# Altium schematic sheet RNG_entropy.SchDoc
size A4; SheetNumber: 2; SheetTotal: 2
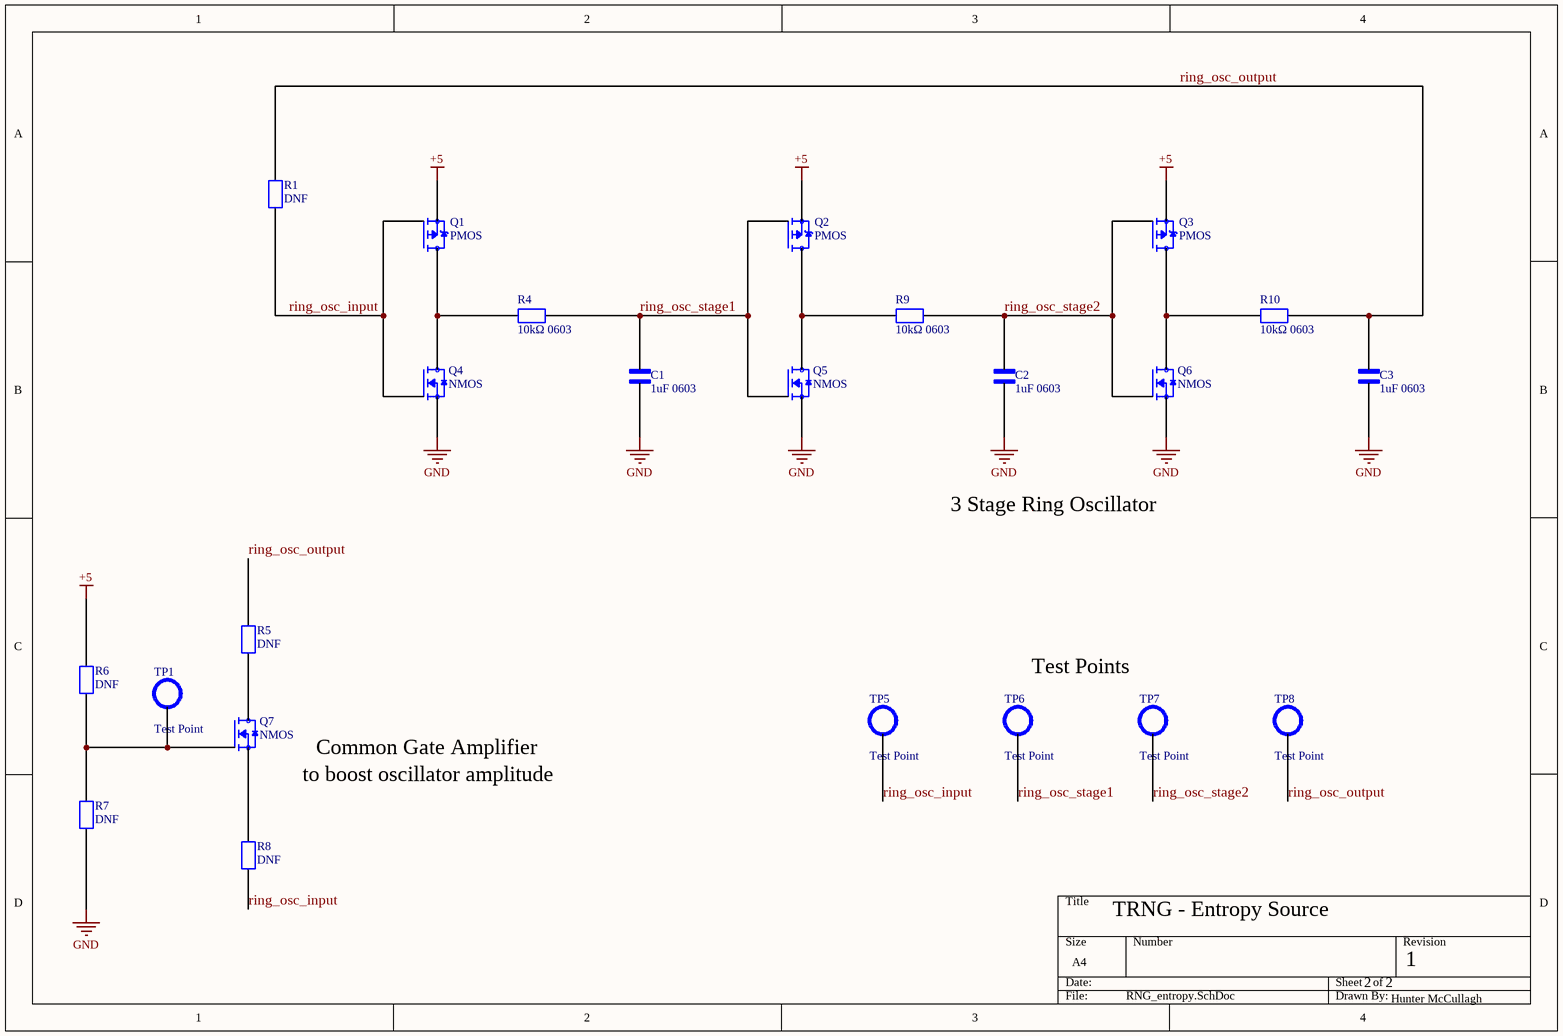
[diagram p0: RNG_entropy.SchDoc]

## Parts
C1  1uF 0603  [0603 PACKAGE]
C2  1uF 0603  [0603 PACKAGE]
C3  1uF 0603  [0603 PACKAGE]
Q1  PMOS  [SOT23-3]
Q2  PMOS  [SOT23-3]
Q3  PMOS  [SOT23-3]
Q4  NMOS  [SOT23-3]
Q5  NMOS  [SOT23-3]
Q6  NMOS  [SOT23-3]
Q7  NMOS  [SOT23-3]
R1  DNF  [0402 PACKAGE]
R4  10kΩ 0603  [0603 PACKAGE]
R5  DNF  [0402 PACKAGE]
R6  DNF  [0603 PACKAGE]
R7  DNF  [0603 PACKAGE]
R8  DNF  [0402 PACKAGE]
R9  10kΩ 0603  [0603 PACKAGE]
R10  10kΩ 0603  [0603 PACKAGE]
TP1  Test Point  [Test Point]
TP5  Test Point  [Test Point]
TP6  Test Point  [Test Point]
TP7  Test Point  [Test Point]
TP8  Test Point  [Test Point]

## Nets
+5: Q1.2(S) Q2.2(S) Q3.2(S) R6.2
GND: C1.1 C2.1 C3.1 Q4.2(S) Q5.2(S) Q6.2(S) R7.1
ring_osc_input: Q1.1(G) Q4.1(G) R1.1 R8.1 TP5.1
ring_osc_output: C3.2 R1.2 R5.2 R10.2 TP8.1
ring_osc_stage1: C1.2 Q2.1(G) Q5.1(G) R4.2 TP6.1
ring_osc_stage2: C2.2 Q3.1(G) Q6.1(G) R9.2 TP7.1
NetQ1_3: Q1.3(D) Q4.3(D) R4.1
NetQ2_3: Q2.3(D) Q5.3(D) R9.1
NetQ3_3: Q3.3(D) Q6.3(D) R10.1
NetQ7_1: Q7.1(G) R6.1 R7.2 TP1.1
NetQ7_2: Q7.2(S) R8.2
NetQ7_3: Q7.3(D) R5.1

## Notes on the sheet
- 3 Stage Ring Oscillator
- Test Points
- to boost oscillator amplitude
- Common Gate Amplifier
- TRNG - Entropy Source
- 2    2
- 1
- Hunter McCullagh

## Library data of the parts
C1-C3 = 0603_Capacitor
Q1-Q3 = AO3401A: P-Channel 30 V 4A (Ta) 1.4W (Ta) Surface Mount SOT-23-3; MF: Alpha & Omega Semiconductor; SnapEDA_Link: https://www.snapeda.com/parts/AO3401A/Alpha/view-part/?ref=snap; Package: SOT-23 Alpha &amp; Omega Semiconductor; Value: *; MP: AO3401A; Check_prices: https://www.snapeda.com/parts/AO3401A/Alpha/view-part/?ref=eda
Q4-Q7 = AO3400A: N-Channel 30 V 5.7A (Ta) 1.4W (Ta) Surface Mount SOT-23-3; MF: Alpha & Omega Semiconductor; SnapEDA_Link: https://www.snapeda.com/parts/AO3400A/Alpha/view-part/?ref=snap; Package: SOT-23 Alpha &amp; Omega Semiconductor Inc.; Value: *; MP: AO3400A; Check_prices: https://www.snapeda.com/parts/AO3400A/Alpha/view-part/?ref=eda
R1 R5 R8 = 0402_Resistor
R4 R6 R7 R9 R10 = 0603_Resistor